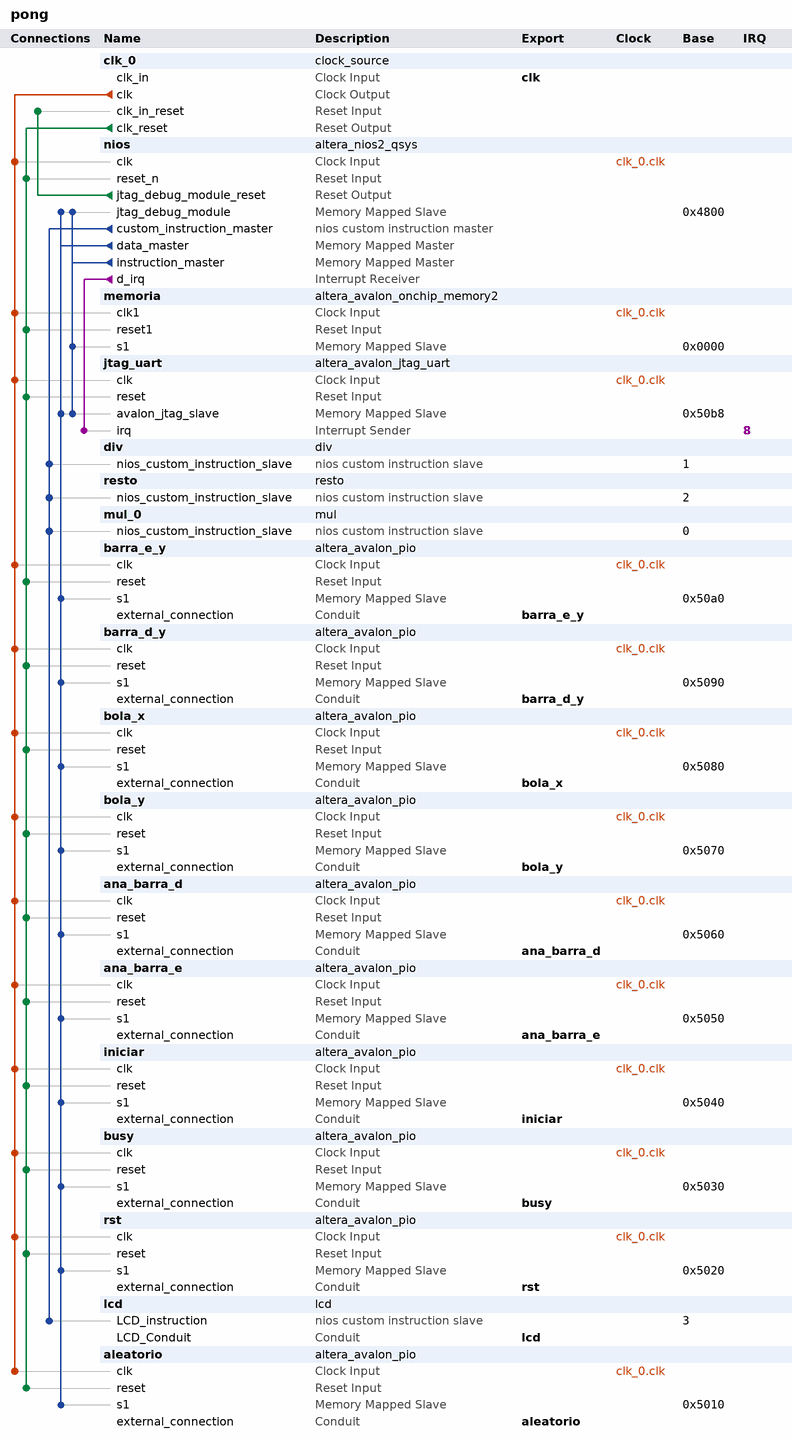
[diagram p0: system contents]
# Platform Designer (Qsys) system pong, Cyclone IV E EP4CE30F23C7
# Parameters at their usual value, and those the tool derives, are not listed.
package require -exact qsys 16.1
create_system pong
set_project_property DEVICE_FAMILY {Cyclone IV E}
set_project_property DEVICE EP4CE30F23C7

add_instance clk_0 clock_source 16.1
set_instance_parameter_value clk_0 clockFrequency 50000000

add_instance nios altera_nios2_qsys 16.1
set_instance_parameter_value nios breakSlave nios.jtag_debug_module
set_instance_parameter_value nios exceptionSlave memoria.s1
set_instance_parameter_value nios icache_size 4096
set_instance_parameter_value nios impl Tiny
set_instance_parameter_value nios mmu_TLBMissExcSlave None
set_instance_parameter_value nios resetSlave memoria.s1
set_instance_parameter_value nios resetrequest_enabled true

add_instance memoria altera_avalon_onchip_memory2 16.1
set_instance_parameter_value memoria dataWidth 32
set_instance_parameter_value memoria dualPort false
set_instance_parameter_value memoria initMemContent true
set_instance_parameter_value memoria initializationFileName C:/intelFPGA_lite/16.1/pong/pong/onchip_mem.hex
set_instance_parameter_value memoria memorySize 12000
set_instance_parameter_value memoria useNonDefaultInitFile true

add_instance jtag_uart altera_avalon_jtag_uart 16.1
set_instance_parameter_value jtag_uart simInteractiveOptions NO_INTERACTIVE_WINDOWS

add_instance div div 1.0
set_instance_parameter_value div latency 0

add_instance resto resto 1.0
set_instance_parameter_value resto latency 0

add_instance mul_0 mul 1.0
set_instance_parameter_value mul_0 latency 0

add_instance barra_e_y altera_avalon_pio 16.1
set_instance_parameter_value barra_e_y direction Output
set_instance_parameter_value barra_e_y width 10

add_instance barra_d_y altera_avalon_pio 16.1
set_instance_parameter_value barra_d_y direction Output
set_instance_parameter_value barra_d_y width 10

add_instance bola_x altera_avalon_pio 16.1
set_instance_parameter_value bola_x direction Output
set_instance_parameter_value bola_x width 10

add_instance bola_y altera_avalon_pio 16.1
set_instance_parameter_value bola_y direction Output
set_instance_parameter_value bola_y width 10

add_instance ana_barra_d altera_avalon_pio 16.1
set_instance_parameter_value ana_barra_d direction Input
set_instance_parameter_value ana_barra_d width 8

add_instance ana_barra_e altera_avalon_pio 16.1
set_instance_parameter_value ana_barra_e direction Input
set_instance_parameter_value ana_barra_e width 8

add_instance iniciar altera_avalon_pio 16.1
set_instance_parameter_value iniciar direction Input
set_instance_parameter_value iniciar width 8

add_instance busy altera_avalon_pio 16.1
set_instance_parameter_value busy direction Output
set_instance_parameter_value busy width 8

add_instance rst altera_avalon_pio 16.1
set_instance_parameter_value rst direction Input
set_instance_parameter_value rst width 8

add_instance lcd lcd 1.0

add_instance aleatorio altera_avalon_pio 16.1
set_instance_parameter_value aleatorio direction Input
set_instance_parameter_value aleatorio width 8

# connections
add_connection clk_0.clk aleatorio.clk clock
add_connection clk_0.clk ana_barra_d.clk clock
add_connection clk_0.clk ana_barra_e.clk clock
add_connection clk_0.clk barra_d_y.clk clock
add_connection clk_0.clk barra_e_y.clk clock
add_connection clk_0.clk bola_x.clk clock
add_connection clk_0.clk bola_y.clk clock
add_connection clk_0.clk busy.clk clock
add_connection clk_0.clk iniciar.clk clock
add_connection clk_0.clk jtag_uart.clk clock
add_connection clk_0.clk memoria.clk1 clock
add_connection clk_0.clk nios.clk clock
add_connection clk_0.clk rst.clk clock
add_connection clk_0.clk_reset aleatorio.reset reset
add_connection clk_0.clk_reset ana_barra_d.reset reset
add_connection clk_0.clk_reset ana_barra_e.reset reset
add_connection clk_0.clk_reset barra_d_y.reset reset
add_connection clk_0.clk_reset barra_e_y.reset reset
add_connection clk_0.clk_reset bola_x.reset reset
add_connection clk_0.clk_reset bola_y.reset reset
add_connection clk_0.clk_reset busy.reset reset
add_connection clk_0.clk_reset iniciar.reset reset
add_connection clk_0.clk_reset jtag_uart.reset reset
add_connection clk_0.clk_reset memoria.reset1 reset
add_connection clk_0.clk_reset nios.reset_n reset
add_connection clk_0.clk_reset rst.reset reset
add_connection nios.jtag_debug_module_reset clk_0.clk_in_reset reset
add_connection nios.data_master aleatorio.s1 avalon
set_connection_parameter_value nios.data_master/aleatorio.s1 baseAddress 0x5010
add_connection nios.data_master ana_barra_d.s1 avalon
set_connection_parameter_value nios.data_master/ana_barra_d.s1 baseAddress 0x5060
add_connection nios.data_master ana_barra_e.s1 avalon
set_connection_parameter_value nios.data_master/ana_barra_e.s1 baseAddress 0x5050
add_connection nios.data_master barra_d_y.s1 avalon
set_connection_parameter_value nios.data_master/barra_d_y.s1 baseAddress 0x5090
add_connection nios.data_master barra_e_y.s1 avalon
set_connection_parameter_value nios.data_master/barra_e_y.s1 baseAddress 0x50a0
add_connection nios.data_master bola_x.s1 avalon
set_connection_parameter_value nios.data_master/bola_x.s1 baseAddress 0x5080
add_connection nios.data_master bola_y.s1 avalon
set_connection_parameter_value nios.data_master/bola_y.s1 baseAddress 0x5070
add_connection nios.data_master busy.s1 avalon
set_connection_parameter_value nios.data_master/busy.s1 baseAddress 0x5030
add_connection nios.data_master iniciar.s1 avalon
set_connection_parameter_value nios.data_master/iniciar.s1 baseAddress 0x5040
add_connection nios.data_master jtag_uart.avalon_jtag_slave avalon
set_connection_parameter_value nios.data_master/jtag_uart.avalon_jtag_slave baseAddress 0x50b8
add_connection nios.data_master nios.jtag_debug_module avalon
set_connection_parameter_value nios.data_master/nios.jtag_debug_module baseAddress 0x4800
add_connection nios.data_master rst.s1 avalon
set_connection_parameter_value nios.data_master/rst.s1 baseAddress 0x5020
add_connection nios.instruction_master jtag_uart.avalon_jtag_slave avalon
set_connection_parameter_value nios.instruction_master/jtag_uart.avalon_jtag_slave baseAddress 0x50b8
add_connection nios.instruction_master memoria.s1 avalon
set_connection_parameter_value nios.instruction_master/memoria.s1 baseAddress 0x0000
add_connection nios.instruction_master nios.jtag_debug_module avalon
set_connection_parameter_value nios.instruction_master/nios.jtag_debug_module baseAddress 0x4800
add_connection nios.d_irq jtag_uart.irq interrupt
set_connection_parameter_value nios.d_irq/jtag_uart.irq irqNumber 8
add_connection nios.custom_instruction_master div.nios_custom_instruction_slave nios_custom_instruction
set_connection_parameter_value nios.custom_instruction_master/div.nios_custom_instruction_slave CIName div_0
set_connection_parameter_value nios.custom_instruction_master/div.nios_custom_instruction_slave baseAddress 1
add_connection nios.custom_instruction_master lcd.LCD_instruction nios_custom_instruction
set_connection_parameter_value nios.custom_instruction_master/lcd.LCD_instruction CIName lcd_0
set_connection_parameter_value nios.custom_instruction_master/lcd.LCD_instruction baseAddress 3
add_connection nios.custom_instruction_master mul_0.nios_custom_instruction_slave nios_custom_instruction
set_connection_parameter_value nios.custom_instruction_master/mul_0.nios_custom_instruction_slave CIName mul_0
set_connection_parameter_value nios.custom_instruction_master/mul_0.nios_custom_instruction_slave baseAddress 0
add_connection nios.custom_instruction_master resto.nios_custom_instruction_slave nios_custom_instruction
set_connection_parameter_value nios.custom_instruction_master/resto.nios_custom_instruction_slave CIName resto_0
set_connection_parameter_value nios.custom_instruction_master/resto.nios_custom_instruction_slave baseAddress 2

# exported interfaces
add_interface aleatorio conduit end
set_interface_property aleatorio EXPORT_OF aleatorio.external_connection
add_interface ana_barra_d conduit end
set_interface_property ana_barra_d EXPORT_OF ana_barra_d.external_connection
add_interface ana_barra_e conduit end
set_interface_property ana_barra_e EXPORT_OF ana_barra_e.external_connection
add_interface barra_d_y conduit end
set_interface_property barra_d_y EXPORT_OF barra_d_y.external_connection
add_interface barra_e_y conduit end
set_interface_property barra_e_y EXPORT_OF barra_e_y.external_connection
add_interface bola_x conduit end
set_interface_property bola_x EXPORT_OF bola_x.external_connection
add_interface bola_y conduit end
set_interface_property bola_y EXPORT_OF bola_y.external_connection
add_interface busy conduit end
set_interface_property busy EXPORT_OF busy.external_connection
add_interface clk clock sink
set_interface_property clk EXPORT_OF clk_0.clk_in
add_interface iniciar conduit end
set_interface_property iniciar EXPORT_OF iniciar.external_connection
add_interface lcd conduit end
set_interface_property lcd EXPORT_OF lcd.LCD_Conduit
add_interface rst conduit end
set_interface_property rst EXPORT_OF rst.external_connection

set_interconnect_requirement {$system} qsys_mm.clockCrossingAdapter HANDSHAKE
set_interconnect_requirement {$system} qsys_mm.enableEccProtection FALSE
set_interconnect_requirement {$system} qsys_mm.insertDefaultSlave FALSE
set_interconnect_requirement {$system} qsys_mm.maxAdditionalLatency 1

save_system pong.qsys
